# Altium schematic sheet Main_Circuit.SchDoc
size A4
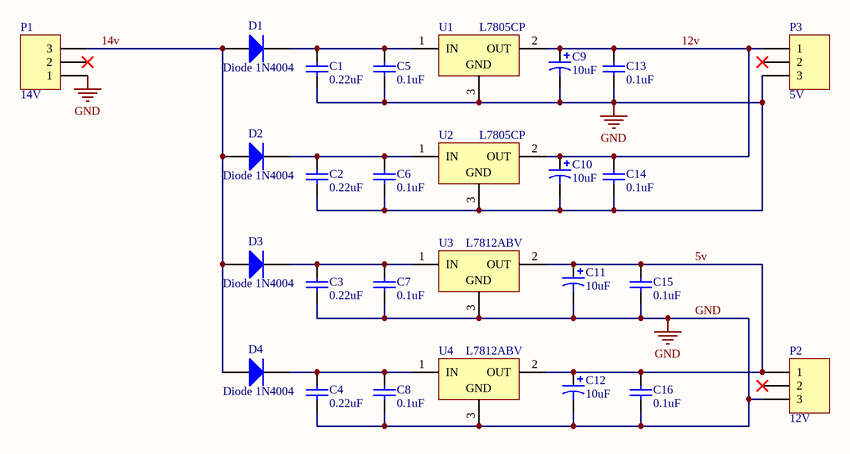
[diagram p0: Main_Circuit.SchDoc]

## Parts
C1  value 0.22uF  [RAD-0.3]  (hidden comment: Cap)
C2  value 0.22uF  [RAD-0.3]  (hidden comment: Cap)
C3  value 0.22uF  [RAD-0.3]  (hidden comment: Cap)
C4  value 0.22uF  [RAD-0.3]  (hidden comment: Cap)
C5  value 0.1uF  [RAD-0.3]  (hidden comment: Cap)
C6  value 0.1uF  [RAD-0.3]  (hidden comment: Cap)
C7  value 0.1uF  [RAD-0.3]  (hidden comment: Cap)
C8  value 0.1uF  [RAD-0.3]  (hidden comment: Cap)
C9  value 10uF  [RB7.6-15]  (hidden comment: Cap Pol1)
C10  value 10uF  [RB7.6-15]  (hidden comment: Cap Pol1)
C11  value 10uF  [RB7.6-15]  (hidden comment: Cap Pol1)
C12  value 10uF  [RB7.6-15]  (hidden comment: Cap Pol1)
C13  value 0.1uF  [RAD-0.3]  (hidden comment: Cap)
C14  value 0.1uF  [RAD-0.3]  (hidden comment: Cap)
C15  value 0.1uF  [RAD-0.3]  (hidden comment: Cap)
C16  value 0.1uF  [RAD-0.3]  (hidden comment: Cap)
D1  Diode 1N4004  [DO-41]
D2  Diode 1N4004  [DO-41]
D3  Diode 1N4004  [DO-41]
D4  Diode 1N4004  [DO-41]
P1  14V  [HDR1X3]
P2  12V  [HDR1X3]
P3  5V  [HDR1X3]
U1  L7805CP  [ISOWATT220AB]
U2  L7805CP  [ISOWATT220AB]
U3  L7812ABV  [TO220ABN]
U4  L7812ABV  [TO220ABN]

## Nets
GND: C1.1 C2.1 C3.1 C4.1 C5.1 C6.1 C7.1 C8.1 C9.2 C10.2 C11.2 C12.2 C13.1 C14.1 C15.1 C16.1 P1.1 P2.3 P3.3 U1.3(GND) U2.3(GND) U3.3(GND) U4.3(GND)
5v: C11.1 C12.1 C15.2 C16.2 P2.1 U3.2(OUT) U4.2(OUT)
12v: C9.1 C10.1 C13.2 C14.2 P3.1 U1.2(OUT) U2.2(OUT)
14v: D1.1(A) D2.1(A) D3.1(A) D4.1(A) P1.3
NetC1_2: C1.2 C5.2 D1.2(K) U1.1(IN)
NetC2_2: C2.2 C6.2 D2.2(K) U2.1(IN)
NetC3_2: C3.2 C7.2 D3.2(K) U3.1(IN)
NetC4_2: C4.2 C8.2 D4.2(K) U4.1(IN)

Not connected (* = marked no-connect by the designer): P1 2*; P2 2*; P3 2*

## Library data of the parts
C1-C8 C13-C16 = Cap: Capacitor; Published: 8-Jun-2000; LatestRevisionDate: 17-Jul-2002; LatestRevisionNote: Re-released for DXP Platform.; PackageReference: RAD-0.3; Publisher: Altium Limited; PackageDescription: Radial Cap, Thru-Hole; 2 Leads; 0.3 in Pin Spacing
C9-C12 = Cap Pol1: Polarized Capacitor (Radial); Published: 8-Jun-2000; LatestRevisionDate: 17-Jul-2002; LatestRevisionNote: Re-released for DXP Platform.; PackageReference: RB7.6-15; Publisher: Altium Limited; PackageDescription: Polarized Capacitor (Radial); 2 Leads
D1-D4 = Diode 1N4004: 1 Amp General Purpose Rectifier; Published: 8-Jun-2000; LatestRevisionDate: 17-Jul-2002; LatestRevisionNote: Re-released for DXP Platform.; DatasheetVersion: 1998; PackageVersion: Aug-1999; PackageReference: DO-41; Publisher: Altium Limited; PackageDescription: Diode, Axial; Body 5.2 x 2.7 mm (LxDia. max), Lead Dia. 0.86 mm (max); Code_JEDEC: DO-204-AL; ComponentLink1Description: Manufacturer Link; ComponentLink1URL: http://www.fairchildsemi.com/; ComponentLink2Description: Datasheet; ComponentLink2URL: http://www.fairchildsemi.com/ds/1N%2F1N4001.pdf
P1-P3 = Header 3: Header, 3-Pin; LatestRevisionDate: 17-Jul-2002; LatestRevisionNote: Re-released for DXP Platform.; Publisher: Altium Limited
U1 U2 = L7805CP: Positive Voltage Regulator; Note: Tab is connected to pin 3 (GND).; Published: 24-Aug-2001; LatestRevisionDate: 17-Jul-2002; LatestRevisionNote: Re-released for DXP Platform.; DatasheetVersion: Dec-1998; PackageVersion: Jul-1998; PackageReference: ISOWATT220AB; Publisher: Altium Limited; PackageDescription: TO, Thru-Hole, Vertical, Heatsink Mounted; 3 In-Line Leads; Pitch 2.54 mm; Pin sequence 1, 3, 2; ComponentLink1Description: Manufacturer Link; ComponentLink1URL: http://www.st.com/
U3 U4 = L7812ABV: Precision 1A Regulator; Published: 24-Aug-2001; LatestRevisionDate: 17-Jul-2002; LatestRevisionNote: Re-released for DXP Platform.; DatasheetVersion: Nov-1999; PackageVersion: Jun-1998; PackageReference: TO220ABN; Publisher: Altium Limited; PackageDescription: TO, Thru-Hole, Vertical, Heatsink Mounted; 3 In-Line Leads; Pitch 2.54 mm; Pin sequence 1, 3, 2; ComponentLink1Description: Manufacturer Link; ComponentLink1URL: http://www.st.com/; ComponentLink2Description: Datasheet; ComponentLink2URL: http://www.st.com/stonline/products/literature/ds/2144/l7805ab.pdf